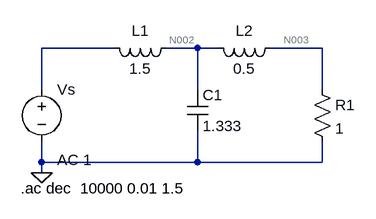
[diagram p0: schematic (2)But.asc]
(2)But.asc, the LTspice schematic file:
Version 4
SHEET 1 880 680
WIRE 112 48 0 48
WIRE 240 48 192 48
WIRE 272 48 240 48
WIRE 432 48 352 48
WIRE 0 112 0 48
WIRE 240 112 240 48
WIRE 432 112 432 48
WIRE 0 224 0 192
WIRE 240 224 240 176
WIRE 240 224 0 224
WIRE 432 224 432 192
WIRE 432 224 240 224
WIRE 0 240 0 224
FLAG 0 240 0
SYMBOL voltage 0 96 R0
WINDOW 123 24 124 Left 2
WINDOW 39 0 0 Left 2
SYMATTR Value2 AC 1
SYMATTR InstName Vs
SYMATTR Value ""
SYMBOL ind 208 32 R90
WINDOW 0 5 56 VBottom 2
WINDOW 3 32 56 VTop 2
SYMATTR InstName L1
SYMATTR Value 1.5
SYMBOL ind 368 32 R90
WINDOW 0 5 56 VBottom 2
WINDOW 3 32 56 VTop 2
SYMATTR InstName L2
SYMATTR Value 0.5
SYMBOL res 416 96 R0
SYMATTR InstName R1
SYMATTR Value 1
SYMBOL cap 224 112 R0
SYMATTR InstName C1
SYMATTR Value 1.333
TEXT -32 264 Left 2 !.ac dec  10000 0.01 1.5

The netlist it stands for:
* (2)But.asc
Vs N001 0 AC 1
L1 N002 N001 1.5
L2 N003 N002 0.5
R1 N003 0 1
C1 N002 0 1.333
.ac dec  10000 0.01 1.5
.backanno
.end

* Results of the author's LTspice run, read from the files saved beside the schematic
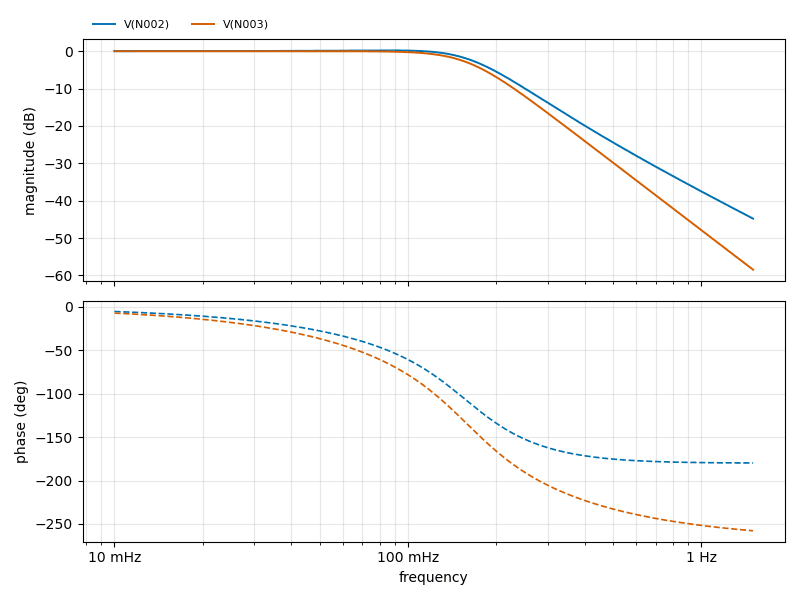
[diagram p1: AC Analysis of (2)But.asc, plotted from the saved traces]
* AC Analysis, 1 run:
*   V(N002): -0.00 dB at 10 mHz, -44.80 dB at 1.5 Hz, peak 0.20 dB at 84.82 mHz, 3 dB below the peak at 169.4 mHz
*   V(N003): -0.02 dB at 10 mHz, -58.45 dB at 1.5 Hz, peak -0.02 dB at 34.15 mHz, 3 dB below the peak at 159.3 mHz